# Altium schematic sheet Buck.SCHDOC
size A4; DocumentNumber: 3; SheetNumber: 3; SheetTotal: 6
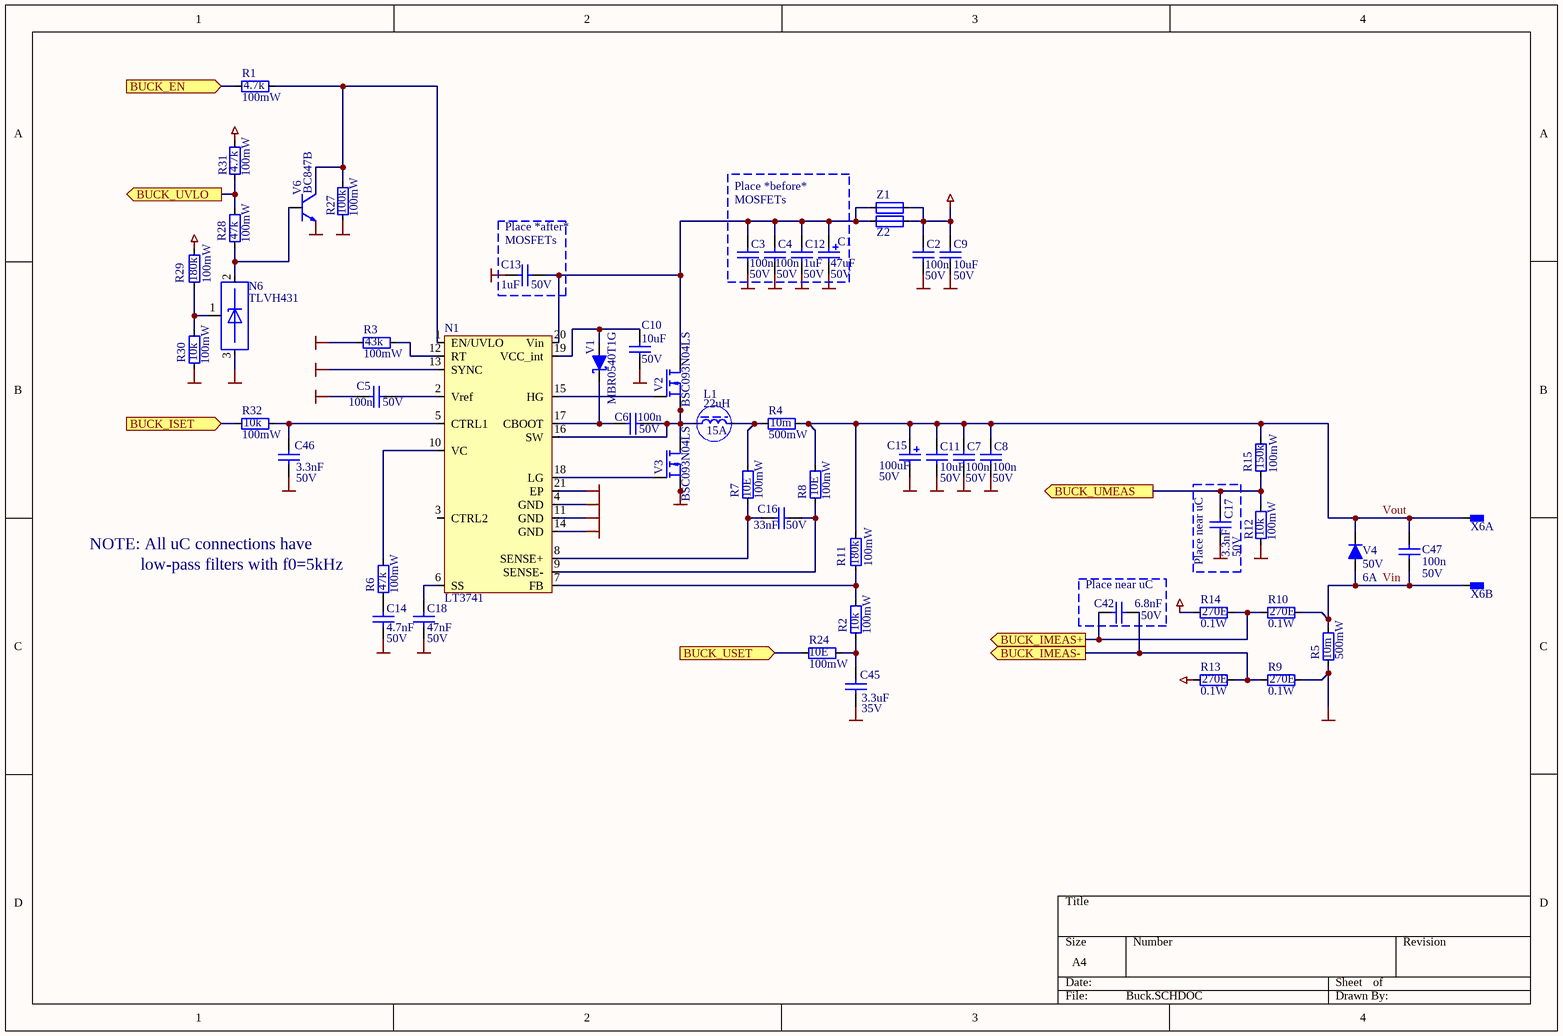
[diagram p0: Buck.SCHDOC]

## Parts
C1  value 47uF  Value2: 50V  [SMD_CAP_CV_8x10L]  (hidden comment: C_SMD_ALU_47U_50V_20%_PCV1H470MCL7GS)
C2  value 100n  Value2: 50V  [SMD_0603]  (hidden comment: C_SMD_CER_100N_50V_10%_X7R_0603)
C3  value 100n  Value2: 50V  [SMD_0603]  (hidden comment: C_SMD_CER_100N_50V_10%_X7R_0603)
C4  value 100n  Value2: 50V  [SMD_0603]  (hidden comment: C_SMD_CER_100N_50V_10%_X7R_0603)
C5  value 100n  Value2: 50V  [SMD_0603]  (hidden comment: C_SMD_CER_100N_50V_10%_X7R_0603)
C6  value 100n  Value2: 50V  [SMD_0603]  (hidden comment: C_SMD_CER_100N_50V_10%_X7R_0603)
C7  value 100n  Value2: 50V  [SMD_0603]  (hidden comment: C_SMD_CER_100N_50V_10%_X7R_0603)
C8  value 100n  Value2: 50V  [SMD_0603]  (hidden comment: C_SMD_CER_100N_50V_10%_X7R_0603)
C9  value 10uF  Value2: 50V  [SMD_1210]  (hidden comment: C_SMD_CER_10U_50V_10%_X7R_1210)
C10  value 10uF  Value2: 50V  [SMD_1210]  (hidden comment: C_SMD_CER_10U_50V_10%_X7R_1210)
C11  value 10uF  Value2: 50V  [SMD_1210]  (hidden comment: C_SMD_CER_10U_50V_10%_X7R_1210)
C12  value 1uF  Value2: 50V  [SMD_0805]  (hidden comment: C_SMD_CER_1U_50V_10%_X7R_0805)
C13  value 1uF  Value2: 50V  [SMD_0805]  (hidden comment: C_SMD_CER_1U_50V_10%_X7R_0805)
C14  value 4.7nF  Value2: 50V  [SMD_0603]  (hidden comment: C_SMD_CER_4N7_50V_10%_X7R_0603)
C15  value 100uF  Value2: 50V  [SMD_CAP_CV_10x12.7L]  (hidden comment: C_SMD_ALU_100U_50V_20%_PCV1H101MCL2GS)
C16  value 33nF  Value2: 50V  [SMD_0603]  (hidden comment: C_SMD_CER_33N_50V_10%_X7R_0603)
C17  value 3.3nF  Value2: 50V  [SMD_0603]  (hidden comment: C_SMD_CER_3N3_50V_10%_X7R_0603)
C18  value 47nF  Value2: 50V  [SMD_0603]  (hidden comment: C_SMD_CER_47N_50V_10%_X7R_0603)
C42  value 6.8nF  Value2: 50V  [SMD_0603]  (hidden comment: C_SMD_CER_6N8_50V_10%_X7R_0603)
C45  value 3.3uF  Value2: 35V  [SMD_0805]  (hidden comment: C_SMD_CER_3U3_35V_10%_X7R_0805)
C46  value 3.3nF  Value2: 50V  [SMD_0603]  (hidden comment: C_SMD_CER_3N3_50V_10%_X7R_0603)
C47  value 100n  Value2: 50V  [SMD_0603]  (hidden comment: C_SMD_CER_100N_50V_10%_X7R_0603)
L1  value 22uH  Value2: 15A  [SMD_INDUCT-74435582200]  (hidden comment: L_SMD_22U_15A_7MOHM_20%_74435582200)
N1  Type: LT3741  [SMD_QFN-20]  (hidden comment: N_LT3741EUF_QFN-20)
N6  Type: TLVH431  [SMD_SOT_23_3]  (hidden comment: N_TLVH431_SOT23-3)
R1  value 4.7k  Value2: 100mW  [SMD_0603]  (hidden comment: R_SMD_THINFILM_4K7_0W1_1%_50PPM_0603)
R2  value 10k  Value2: 100mW  [SMD_0603]  (hidden comment: R_SMD_THINFILM_10K_0W1_1%_50PPM_0603)
R3  value 43k  Value2: 100mW  [SMD_0603]  (hidden comment: R_SMD_THINFILM_43K_0W1_0.1%_25PPM_0603)
R4  value 10m  Value2: 500mW  [SMD_1206]  (hidden comment: R_SMD_THICKFILM_0E01_0W5_0.5%_50PPM_1206)
R5  value 10m  Value2: 500mW  [SMD_1206]  (hidden comment: R_SMD_THICKFILM_0E01_0W5_0.5%_50PPM_1206)
R6  value 47k  Value2: 100mW  [SMD_0603]  (hidden comment: R_SMD_THINFILM_47K_0W1_1%_50PPM_0603)
R7  value 10E  Value2: 100mW  [SMD_0603]  (hidden comment: R_SMD_THINFILM_10E_0W1_1%_50PPM_0603)
R8  value 10E  Value2: 100mW  [SMD_0603]  (hidden comment: R_SMD_THINFILM_10E_0W1_1%_50PPM_0603)
R9  value 270E  Value2: 0.1W  [SMD_0603]  (hidden comment: R_SMD_THINFILM_270E_0W1_1%_50PPM_0603)
R10  value 270E  Value2: 0.1W  [SMD_0603]  (hidden comment: R_SMD_THINFILM_270E_0W1_1%_50PPM_0603)
R11  value 180k  Value2: 100mW  [SMD_0603]  (hidden comment: R_SMD_THINFILM_180K_0W1_0.1%_25PPM_0603)
R12  value 10k  Value2: 100mW  [SMD_0603]  (hidden comment: R_SMD_THINFILM_10K_0W1_1%_50PPM_0603)
R13  value 270E  Value2: 0.1W  [SMD_0603]  (hidden comment: R_SMD_THINFILM_270E_0W1_1%_50PPM_0603)
R14  value 270E  Value2: 0.1W  [SMD_0603]  (hidden comment: R_SMD_THINFILM_270E_0W1_1%_50PPM_0603)
R15  value 150k  Value2: 100mW  [SMD_0603]  (hidden comment: R_SMD_THINFILM_150K_0W1_1%_50PPM_0603)
R24  value 10E  Value2: 100mW  [SMD_0603]  (hidden comment: R_SMD_THINFILM_10E_0W1_1%_50PPM_0603)
R27  value 100k  Value2: 100mW  [SMD_0603]  (hidden comment: R_SMD_THINFILM_100K_0W1_1%_50PPM_0603)
R28  value 47k  Value2: 100mW  [SMD_0603]  (hidden comment: R_SMD_THINFILM_47K_0W1_1%_50PPM_0603)
R29  value 180k  Value2: 100mW  [SMD_0603]  (hidden comment: R_SMD_THINFILM_180K_0W1_0.1%_25PPM_0603)
R30  value 10k  Value2: 100mW  [SMD_0603]  (hidden comment: R_SMD_THINFILM_10K_0W1_1%_50PPM_0603)
R31  value 4.7k  Value2: 100mW  [SMD_0603]  (hidden comment: R_SMD_THINFILM_4K7_0W1_1%_50PPM_0603)
R32  value 10k  Value2: 100mW  [SMD_0603]  (hidden comment: R_SMD_THINFILM_10K_0W1_1%_50PPM_0603)
V1  Type: MBR0540T1G  [SMD_SOD_123]  (hidden comment: V_SMD_SCHOTTKY_MBR0540T1G_40V_0A5_SOD-123)
V2  Type: BSC093N04LS  [SMD_PG-TDSON-8]  (hidden comment: V_SMD_FET_NMOS_BSC093N04LS_40V_13A_24NC_0E0093_PG-TDSON-8)
V3  Type: BSC093N04LS  [SMD_PG-TDSON-8]  (hidden comment: V_SMD_FET_NMOS_BSC093N04LS_40V_13A_24NC_0E0093_PG-TDSON-8)
V4  value 50V  Value2: 6A  [THT_6A05-T_2]  (hidden comment: V_THT_DIODE_6A05-T_50V_6A)
V6  Type: BC847B  [SMD_SOT_23_3]  (hidden comment: V_SMD_TRANS_NPN_BC847B_50V_0A2_SOT-23-3)
X6  X_CONNECTOR_P2.54_D0.9_1X2  [THT_CON_P2.54_D0.9_1X2]  (value not drawn)  (parts A,B of 2)
Z1  Z_SMD_FERRITE_5A_60E@100MHZ_0805  [SMD_0805]  (value not drawn)
Z2  Z_SMD_FERRITE_5A_60E@100MHZ_0805  [SMD_0805]  (value not drawn)

## Blocks framed on the sheet
Place near uC: C17
Place near uC: C42

## Ports
BUCK_EN (in), BUCK_IMEAS+ (out), BUCK_IMEAS- (out), BUCK_ISET (in), BUCK_UMEAS (out), BUCK_USET (in), BUCK_UVLO (out)

## Nets
+3.3V: R13.2 R14.2 R31.2
+36V: C2.2 C9.2 R29.2 Z1.2 Z2.2
GND: C1.1 C2.1 C3.1 C4.1 C5.2 C7.1 C8.1 C9.1 C10.2 C11.1 C12.1 C13.2 C14.1 C15.1 C17.1 C18.1 C45.1 C46.1 N1.4(GND) N1.11(GND) N1.13(SYNC) N1.14(GND) N1.21(EP) N6.3 R3.1 R5.1 R9.1 R12.1 R27.1 R30.1 V3.1(Source1) V3.2(Source2) V3.3(Source3) V6.2(E)
BUCK_EN: R1.1 ; port BUCK_EN
BUCK_IMEAS+: C42.1 R10.2 R14.1 ; port BUCK_IMEAS+
BUCK_IMEAS-: C42.2 R9.2 R13.1 ; port BUCK_IMEAS-
BUCK_ISET: R32.1 ; port BUCK_ISET
BUCK_UMEAS: C17.2 R12.2 R15.1 ; port BUCK_UMEAS
BUCK_USET: R24.1 ; port BUCK_USET
BUCK_UVLO: R28.2 R31.1 ; port BUCK_UVLO
Vin: C47.1 R5.2 R10.1 V4.1 X6.2
Vout: C7.2 C8.2 C11.2 C15.2 C47.2 R4.2 R8.2 R11.2 R15.2 V4.2 X6.1
NetC1_2: C1.2 C3.2 C4.2 C12.2 C13.1 N1.20(Vin) V2.5(Drain) Z1.1 Z2.1
NetC5_1: C5.1 N1.2(Vref)
NetC6_1: C6.1 N1.17(CBOOT) V1.2
NetC6_2: C6.2 L1.1 N1.16(SW) V2.1(Source1) V2.2(Source2) V2.3(Source3) V3.5(Drain)
NetC10_1: C10.1 N1.19(VCC_int) V1.1
NetC14_2: C14.2 R6.1
NetC16_1: C16.1 N1.9(SENSE-) R8.1
NetC16_2: C16.2 N1.8(SENSE+) R7.1
NetC18_2: C18.2 N1.6(SS)
NetC45_2: C45.2 R2.2 R24.2
NetC46_2: C46.2 N1.5(CTRL1) R32.2
NetL1_2: L1.2 R4.1 R7.2
NetN1_1: N1.1(EN/UVLO) R1.2 R27.2 V6.3(C)
NetN1_7: N1.7(FB) R2.1 R11.1
NetN1_10: N1.10(VC) R6.2
NetN1_12: N1.12(RT) R3.2
NetN1_15: N1.15(HG) V2.4(Gate)
NetN1_18: N1.18(LG) V3.4(Gate)
NetN6_1: N6.1 R29.1 R30.2
NetN6_2: N6.2 R28.1 V6.1(B)

Not connected (* = marked no-connect by the designer): N1 3(CTRL2)

## Notes on the sheet
- (near C13) Place *after*
- (near C13) MOSFETs
- Place *before*
- MOSFETs
- NOTE: All uC connections have
- (near R6) low-pass filters with f0=5kHz

## Library data of the parts
C2-C8 C47 = C_SMD_CER_100N_50V_10%_X7R_0603: SMD Capacitor; Supplier - E+H-flowtec SAP: 50092748; Supplier - Digikey: 1276-1936-1-ND
C9-C11 = C_SMD_CER_10U_50V_10%_X7R_1210: SMD Ceramic capacitor; Supplier - Digikey: 490-6544-1-ND
C14 = C_SMD_CER_4N7_50V_10%_X7R_0603: SMD Capacitor ceramic; Supplier - E+H-flowtec SAP: 50092742; Supplier - Digikey: 478-1223-1-ND
C17 C46 = C_SMD_CER_3N3_50V_10%_X7R_0603: Thinfilm Ceramic Capacitor; Supplier - Digikey: 490-1503-1-ND
C18 = C_SMD_CER_47N_50V_10%_X7R_0603: SMD capacitor; Supplier - E+H-flowtec SAP: 50092746; Supllier - Digikey: 1276-1063-1-ND
L1 = L_SMD_22U_15A_7MOHM_20%_74435582200: Core Material: Manganese Zinc; Supplier - Digikey: 732-4237-1-ND
N1 = N_LT3741EUF_QFN-20: High Power, CCVC, Step-Down Controller; Supplier - Digikey: LT3741EUF#PBF-ND
N6 = N_TLVH431_SOT23-3: LOW-VOLTAGE ADJUSTABLE PRECISION SHUNT REGULATORS; Supplier - E+H-flowtec SAP: 71120701; Supplier - Digikey: 296-17972-1-ND
R1 R31 = R_SMD_THINFILM_4K7_0W1_1%_50PPM_0603: SMD Resistor; Supplier - E+H-flowtec SAP: 50092694; Supplier - Digikey: YAG1238CT-ND
R2 R12 R30 R32 = R_SMD_THINFILM_10K_0W1_1%_50PPM_0603: SMD Resistor; Supplier - E+H-flowtec SAP: 50092700; Supplier - Digikey: YAG2321CT-ND
R3 = R_SMD_THINFILM_43K_0W1_0.1%_25PPM_0603: SMD Resistor; Supplier - Digikey: P43KDBCT-ND
R4 R5 = R_SMD_THICKFILM_0E01_0W5_0.5%_50PPM_1206: SMD Current sense resistor; Supplier - Digikey: LVK12R010DERCT-ND
R6 R28 = R_SMD_THINFILM_47K_0W1_1%_50PPM_0603: SMD Resistor; Supplier - E+H-flowtec SAP: 50092708; Supplier - Digikey: YAG3355CT-ND
R7 R8 R24 = R_SMD_THINFILM_10E_0W1_1%_50PPM_0603: SMD Resistor; Supplier - E+H-flowtec SAP: 50092664; Supplier - Digikey: YAG3351CT-ND
R9 R10 R13 R14 = R_SMD_THINFILM_270E_0W1_1%_50PPM_0603: SMD Resistor; Supplier - E+H-flowtec SAP: 50098310; Supplier - Digikey: P270DBCT-ND
R11 R29 = R_SMD_THINFILM_180K_0W1_0.1%_25PPM_0603: SMD Resistor; Supplier - Digikey: P180KDBCT-ND
R15 = R_SMD_THINFILM_150K_0W1_1%_50PPM_0603: SMD Resistor; Supplier - E+H-flowtec SAP: 50092716; Supplier - Digikey: P150KDBCT-ND
R27 = R_SMD_THINFILM_100K_0W1_1%_50PPM_0603: SMD Resistor; Supplier - E+H-flowtec SAP: 50092714; Supplier - Digikey: YAG2319CT-ND
V1 = V_SMD_SCHOTTKY_MBR0540T1G_40V_0A5_SOD-123: Schottky diode, 40V, 500mA, SOD-123; Supplier - Digikey: MBR0540T1GOSCT-ND
V2 V3 = V_SMD_FET_NMOS_BSC093N04LS_40V_13A_24NC_0E0093_PG-TDSON-8: Fast switching mosfet for SMPS; Supplier - Digikey: BSC093N04LS GCT-ND
V4 = V_THT_DIODE_6A05-T_50V_6A: 6A05-T; Supplier - Digikey: 6A05DICT-ND
V6 = V_SMD_TRANS_NPN_BC847B_50V_0A2_SOT-23-3: NPN Transistor; Supplier - E+H-flowtec SAP: 50019820; Supplier - Digikey: BC847BLT1GOSCT-ND
X6 = X_CONNECTOR_P2.54_D0.9_1X2: Pitch 2.54, Diameter 0.9mm, 1 row, 2 columns; Type: Pitch 2.54, Diameter 0.9mm, 1 row, 2 columns
Z1 Z2 = Z_SMD_FERRITE_5A_60E@100MHZ_0805: BEAD FERRITE 60 OHM 5A; Supplier - Digikey: MH2029-600YCT-ND; Type: MH2029-600Y; Value: 5A
C1 = C_SMD_ALU_47U_50V_20%_PCV1H470MCL7GS: Supplier - Digikey: 493-4554-1-ND
C12 C13 = C_SMD_CER_1U_50V_10%_X7R_0805: Supplier - Digikey: 587-2910-1-ND
C15 = C_SMD_ALU_100U_50V_20%_PCV1H101MCL2GS: Supplier - Digikey: 493-4558-1-ND
C16 = C_SMD_CER_33N_50V_10%_X7R_0603: Supplier - Digikey: 1276-2042-1-ND
C42 = C_SMD_CER_6N8_50V_10%_X7R_0603: Supplier - Digikey: 1276-1185-1-ND
C45 = C_SMD_CER_3U3_35V_10%_X7R_0805: Supplier - Digikey: 445-7553-1-ND